# EAGLE design AR0130_DEV_BOARD_BREAKOUT (EAGLE 8.7.1)
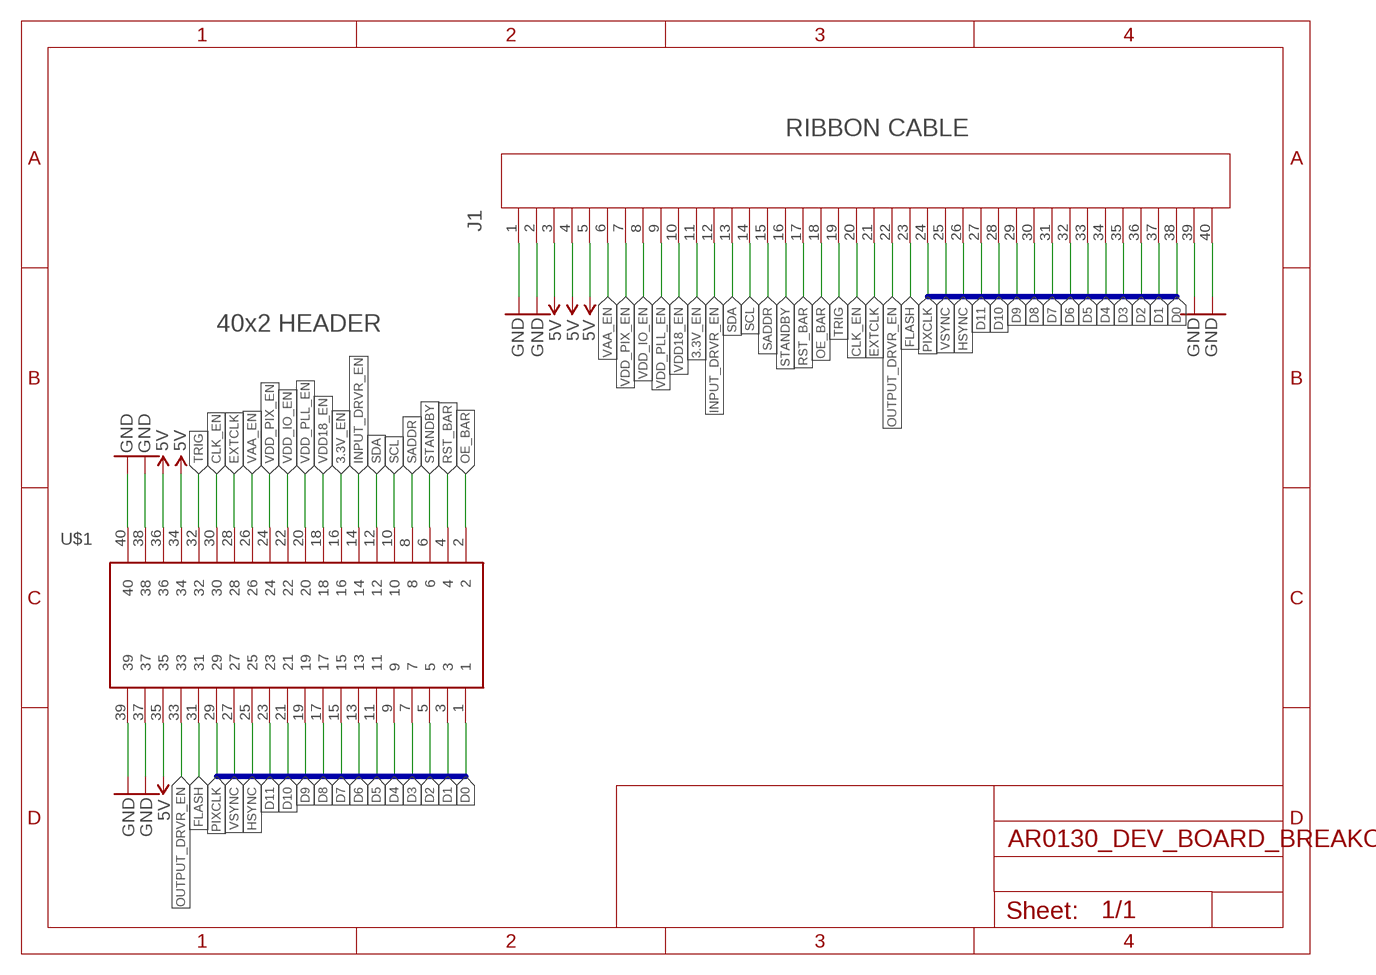
[diagram p0: schematic, sheet 1]

## Parts
J1  4-1734592-0  [CONN_4-1734592-0_TYCO]
U$1  HTSW-120-XX-XXX-D  [CON40_2X20_TU_TSW]

## Nets
3.3V_EN: J1.11 U$1.16
5V: J1.3 J1.4 J1.5 U$1.34 U$1.35 U$1.36
CLK_EN: J1.20 U$1.30
D0: J1.38 U$1.1
D1: J1.37 U$1.3
D2: J1.36 U$1.5
D3: J1.35 U$1.7
D4: J1.34 U$1.9
D5: J1.33 U$1.11
D6: J1.32 U$1.13
D7: J1.31 U$1.15
D8: J1.30 U$1.17
D9: J1.29 U$1.19
D10: J1.28 U$1.21
D11: J1.27 U$1.23
EXTCLK: J1.21 U$1.28
FLASH: J1.23 U$1.31
GND: J1.1 J1.2 J1.39 J1.40 U$1.37 U$1.38 U$1.39 U$1.40
HSYNC: J1.26 U$1.25
INPUT_DRVR_EN: J1.12 U$1.14
OE_BAR: J1.18 U$1.2
OUTPUT_DRVR_EN: J1.22 U$1.33
PIXCLK: J1.24 U$1.29
RST_BAR: J1.17 U$1.4
SADDR: J1.15 U$1.8
SCL: J1.14 U$1.10
SDA: J1.13 U$1.12
STANDBY: J1.16 U$1.6
TRIG: J1.19 U$1.32
VAA_EN: J1.6 U$1.26
VDD18_EN: J1.10 U$1.18
VDD_IO_EN: J1.8 U$1.22
VDD_PIX_EN: J1.7 U$1.24
VDD_PLL_EN: J1.9 U$1.20
VSYNC: J1.25 U$1.27

## Buses
D[0..11],HSYNC,VSYNC,PIXCLK

## Notes on the sheet
- RIBBON CABLE
- 40x2 HEADER

## Library data of the parts
J1 = Oliver_Custom:4-1734592-0; MANUFACTURER_PART_NUMBER: 417345920; VENDOR: TE Connectivity
U$1 = Oliver_Custom:HTSW-120-XX-XXX-D

## Board
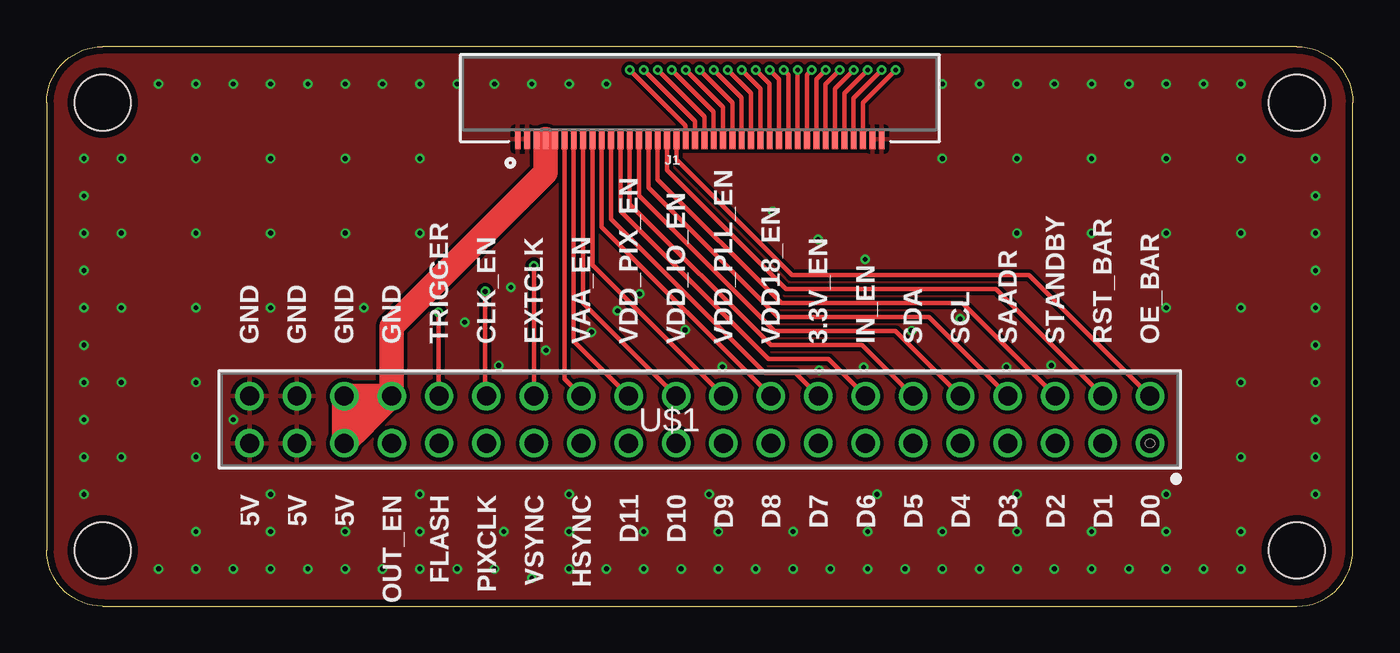
[diagram p1: board, top side]
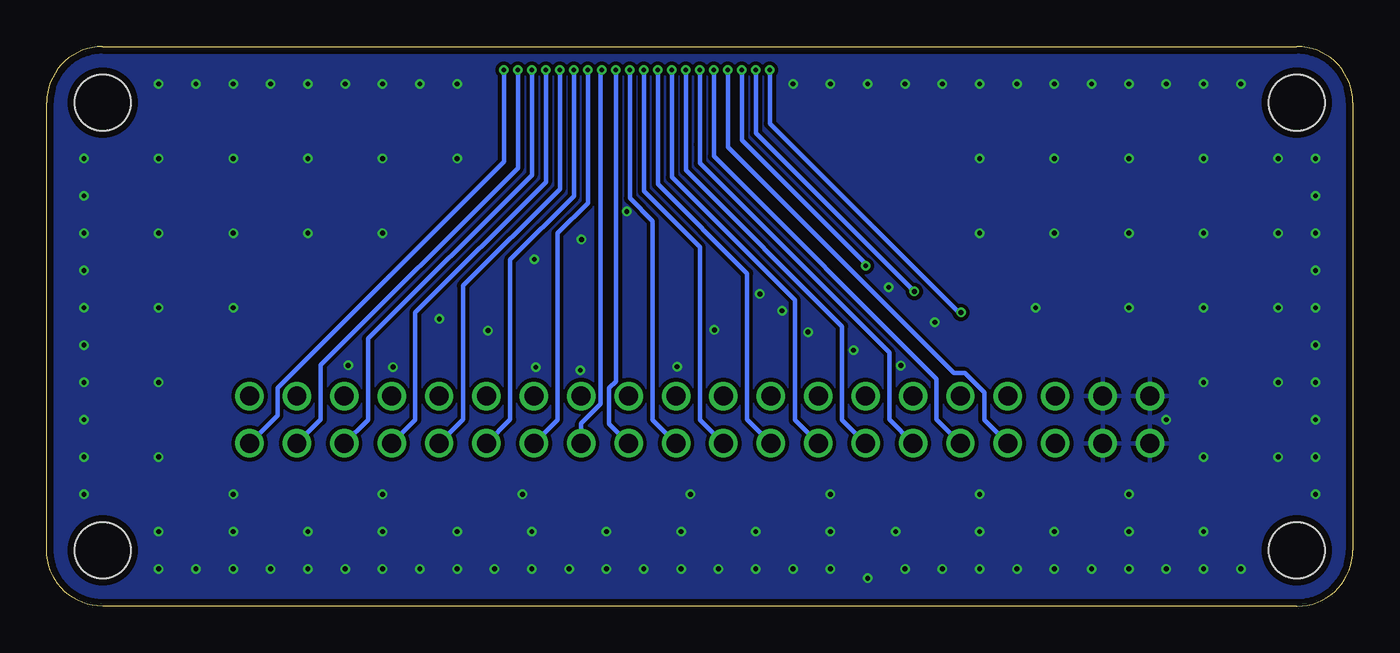
[diagram p2: board, bottom side, seen from below]

Size 70 x 30 mm. Coordinates in mm from the lower left corner, seen from the top.
Outline: 3,0 67,0 arc90 70,3 70,27 arc90 67,30 3,30 arc90 0,27 0,3 arc90 3,0
Copper layers (1*16): Top 0.035559375mm / dielectric 1.6mm / Bottom 0.035559375mm
Design rules "oshpark-2layer-tented": minimum track width 6mil, minimum drill 10mil, track to track 6mil, track to pad 6mil, pad to pad 6mil, via to via 6mil, smd to smd 6mil, copper to edge 15mil, drill to drill 6mil, minimum pad ring 5mil, minimum via ring 5mil, stop-mask expansion 2.5mil, vias tented up to drill 20mil, thermal gap 10mil
Holes 3 mm at 3,3 67,3 3,27 67,27

### Footprints (pad centres in the part's own frame; a part is rotated, then mirrored left to right if it is on the bottom)
CONN_4-1734592-0_TYCO = smd 0.305 x 1.092: 1 -9.751,0; 2 -9.251,0; 3 -8.751,0; 4 -8.251,0; 5 -7.75,0; 6 -7.25,0; 7 -6.75,0; 8 -6.25,0; 9 -5.751,0; 10 -5.25,0; 11 -4.75,0; 12 -4.25,0; 13 -3.751,0; 14 -3.251,0; 15 -2.751,0; 16 -2.251,0; 17 -1.75,0; 18 -1.25,0; 19 -0.751,0; 20 -0.251,0; 21 0.249,0; 22 0.75,0; 23 1.25,0; 24 1.749,0; 25 2.249,0; 26 2.749,0; 27 3.249,0; 28 3.749,0; 29 4.249,0; 30 4.75,0; 31 5.25,0; 32 5.749,0; 33 6.25,0; 34 6.749,0; 35 7.25,0; 36 7.75,0; 37 8.249,0; 38 8.749,0; 39 9.249,0; 40 9.749,0
CON40_2X20_TU_TSW = drill 1.016 pad 1.524: 1 24.13,-1.27; 2 24.13,1.27; 3 21.59,-1.27; 4 21.59,1.27; 5 19.05,-1.27; 6 19.05,1.27; 7 16.51,-1.27; 8 16.51,1.27; 9 13.97,-1.27; 10 13.97,1.27; 11 11.43,-1.27; 12 11.43,1.27; 13 8.89,-1.27; 14 8.89,1.27; 15 6.35,-1.27; 16 6.35,1.27; 17 3.81,-1.27; 18 3.81,1.27; 19 1.27,-1.27; 20 1.27,1.27; 21 -1.27,-1.27; 22 -1.27,1.27; 23 -3.81,-1.27; 24 -3.81,1.27; 25 -6.35,-1.27; 26 -6.35,1.27; 27 -8.89,-1.27; 28 -8.89,1.27; 29 -11.43,-1.27; 30 -11.43,1.27; 31 -13.97,-1.27; 32 -13.97,1.27; 33 -16.51,-1.27; 34 -16.51,1.27; 35 -19.05,-1.27; 36 -19.05,1.27; 37 -21.59,-1.27; 38 -21.59,1.27; 39 -24.13,-1.27; 40 -24.13,1.27

### Placement (x,y rotation side)
J1  35,25.04 0 top
U$1  35,10 0 top

### Tracks (layer width: path | path; a pad name or v marks a point on that pad's centre or on a via)
3.3V_EN
  Top 0.254: J1.11 30.25,20.75 38.5,12.5 40.12,12.5 U$1.16
5V
  Top 0.254: J1.3 J1.4 J1.5
  Top 1.3: U$1.35 U$1.36 17,11.27 | 17,11.27 U$1.34 | U$1.34 18.49,14.99 26.75,23.25 J1.4 | U$1.35 U$1.34 | U$1.35 17,9.78 17,11.27
CLK_EN  (via drill 0.25)
  Top 0.254: J1.20 34.75,26 32.53,28.22 32.22,28.53 v32,28.75 | v23.5,16.88 23.5,11.34 U$1.30
  Bottom 0.254: v32,28.75 32,25.38 v23.5,16.88
D0  (via drill 0.25 pad 0.46)
  Top 0.254: J1.38 43.75,27 44.97,28.22 45.28,28.53 v45.5,28.75
  Bottom 0.254: U$1.1 57.63,10.23 57.63,11.7 45.5,23.83 v45.5,28.75
D1  (via drill 0.25 pad 0.46)
  Top 0.254: J1.37 43.25,27.25 44.22,28.22 44.53,28.53 v44.75,28.75
  Bottom 0.254: U$1.3 55.31,10.01 55.31,12.94 44.75,23.5 v44.75,28.75
D2  (via drill 0.25 pad 0.46)
  Top 0.254: J1.36 42.75,27.5 43.47,28.22 43.78,28.53 v44,28.75
  Bottom 0.254: U$1.5 52.78,10 52.78,14.34 44,23.12 v44,28.75
D3  (via drill 0.25 pad 0.46)
  Top 0.254: J1.35 42.25,27.75 42.72,28.22 43.03,28.53 v43.25,28.75
  Bottom 0.254: v43.25,28.75 43.25,22.75 50.25,15.75 50.25,9.99 U$1.7
D4  (via drill 0.25 pad 0.46)
  Top 0.254: J1.34 41.75,28 41.97,28.22 42.28,28.53 v42.5,28.75
  Bottom 0.254: v42.5,28.75 42.5,22.38 47.69,17.19 47.69,10.01 U$1.9
D5  (via drill 0.25 pad 0.46)
  Top 0.254: J1.33 41.25,28.25 41.53,28.53 v41.75,28.75
  Bottom 0.254: U$1.11 45.16,10 45.16,18.59 41.75,22 v41.75,28.75
D6  (via drill 0.25 pad 0.46)
  Top 0.254: J1.32 40.75,28.5 40.78,28.53 v41,28.75
  Bottom 0.254: U$1.13 42.62,9.99 42.62,20 41,21.62 v41,28.75
D7  (via drill 0.25 pad 0.46)
  Top 0.254: J1.31 v40.25,28.75
  Bottom 0.254: U$1.15 41.35,9.8 40.31,10.84 40.31,28.69 v40.25,28.75
D8  (via drill 0.25 pad 0.46)
  Top 0.254: J1.30 39.75,28.5 39.72,28.53 v39.5,28.75
  Bottom 0.254: v39.5,28.75 39.5,12.05 39.85,11.7 39.85,9.77 U$1.17
D9  (via drill 0.25 pad 0.46)
  Top 0.254: J1.29 39.25,28.25 38.97,28.53 v38.75,28.75
  Bottom 0.254: U$1.19 37.53,9.99 37.53,20.66 38.75,21.88 v38.75,28.75
D10  (via drill 0.25 pad 0.46)
  Top 0.254: J1.28 38.75,28 38.53,28.22 38.22,28.53 v38,28.75
  Bottom 0.254: U$1.21 35,10 35,19.25 38,22.25 v38,28.75
D11  (via drill 0.25 pad 0.46)
  Top 0.254: J1.27 38.25,27.75 37.78,28.22 37.47,28.53 v37.25,28.75
  Bottom 0.254: U$1.23 32.47,10.01 32.47,17.84 37.25,22.62 v37.25,28.75
EXTCLK  (via drill 0.25)
  Top 0.254: J1.21 35.25,26.25 33.28,28.22 32.97,28.53 v32.75,28.75 | 26.11,18.36 v26.11,18.25 U$1.28
  Bottom 0.254: v32.75,28.75 32.75,25 26.11,18.36 v26.11,18.25
FLASH  (via drill 0.25)
  Top 0.254: J1.23 36.25,26.75 34.78,28.22 34.47,28.53 v34.25,28.75
  Bottom 0.254: v34.25,28.75 34.25,24.12 22.31,12.19 22.31,10.01 U$1.31
GND  (via drill 0.25)
  other vias: 10,10 6,2 8,2 10,2 12,2 14,2 16,2 18,2 20,2 22,2 24,2 26,1.5 28,2 30,2 32,2 34,2 36,2 38,2 40,2 42,2 44,2 46,2 48,2 50,2 52,2 54,2 56,2 58,2 60,2 62,2 64,2 68,6 68,8 68,10 68,12 68,14 68,16 68,18 68,20 68,22 2,6 2,8 2,10 2,12 2,14 2,16 2,18 2,20 2,22 2,24 6,28 8,28 10,28 12,28 14,28 16,28 18,28 20,28 22,28 24,28 26,28 28,28 30,28 48,28 50,28 52,28 54,28 56,28 58,28 60,28 62,28 64,28 8,24 12,24 16,24 20,24 20,20 16,20 12,20 8,20 8,16 12,16 17,16 4,16 4,20 4,24 4,12 8,12 8,8 4,8 8,4 12,4 16,4 20,4 24.5,4 28,4 32,4 36,4 40,4 44,4 48,4 52,4 56,4 60,4 64,4 64,8 64,12 64,16 60,16 60,20 64,20 64,24 60,24 68,24 56,24 56,20 52,20 52,24 48,24 22.4,15.22 24.88,17.1 31.77,16.74 34.21,14.81 36.21,12.84 30.59,15.84 41.34,19.66 43.86,18.6 46.35,14.78 48.95,15.4 53.84,12.91 51.44,12.82 43.79,12.81 41.4,12.65 38.91,21.16 29.2,14.7 26.76,13.72 24.23,12.9 12,6 20,6 28,6 35.5,6 44.5,6 52,6 60,6
  pour Top (isolate 0.2): 0,0 70,0 70,25.75 70,30 44.5,30 0,30
  pour Bottom (isolate 0.2): 0,0 70,0 70,25.75 70,30 44.5,30 0,30
HSYNC  (via drill 0.25 pad 0.46)
  Top 0.254: J1.26 37.75,27.5 37.03,28.22 36.72,28.53 v36.5,28.75
  Bottom 0.254: U$1.25 29.91,9.99 29.91,16.41 36.5,23 v36.5,28.75
INPUT_DRVR_EN
  Top 0.254: J1.12 30.75,21.19 38.69,13.25 41.91,13.25 U$1.14
OE_BAR
  Top 0.254: J1.18 33.75,23.94 39.94,17.75 52.65,17.75 U$1.2
OUTPUT_DRVR_EN  (via drill 0.25)
  Top 0.254: J1.22 35.75,26.5 34.03,28.22 33.72,28.53 v33.5,28.75
  Bottom 0.254: U$1.33 19.75,9.99 19.75,11.46 20.79,12.5 21.38,12.5 33.5,24.62 v33.5,28.75
PIXCLK  (via drill 0.25 pad 0.46)
  Top 0.254: J1.24 36.75,27 35.53,28.22 35.22,28.53 v35,28.75
  Bottom 0.254: U$1.29 24.84,10 24.84,13.59 35,23.75 35,24.75 v35,28.75
RST_BAR
  Top 0.254: J1.17 33.25,23.38 39.62,17 50.86,17 U$1.4
SADDR
  Top 0.254: J1.15 32.25,22.44 39.19,15.5 47.28,15.5 U$1.8
SCL
  Top 0.254: J1.14 31.75,22 39,14.75 45.49,14.75 U$1.10
SDA
  Top 0.254: J1.13 31.25,21.56 38.81,14 43.7,14 U$1.12
STANDBY
  Top 0.254: J1.16 32.75,22.88 39.38,16.25 49.07,16.25 U$1.6
TRIG  (via drill 0.25)
  Top 0.254: J1.19 34.25,25.75 31.78,28.22 31.47,28.53 v31.25,28.75 | v21,15.75 21,11.3 U$1.32
  Bottom 0.254: v31.25,28.75 31.25,25.88 21.12,15.75 v21,15.75
VAA_EN
  Top 0.254: J1.6 27.75,12.17 U$1.26
VDD18_EN
  Top 0.254: J1.10 29.75,20.33 U$1.18
VDD_IO_EN
  Top 0.254: J1.8 28.75,16.25 U$1.22
VDD_PIX_EN
  Top 0.254: J1.7 28.25,14.21 U$1.24
VDD_PLL_EN
  Top 0.254: J1.9 29.25,18.29 U$1.20
VSYNC  (via drill 0.25 pad 0.46)
  Top 0.254: J1.25 37.25,27.25 36.28,28.22 35.97,28.53 v35.75,28.75
  Bottom 0.254: U$1.27 27.38,9.99 27.38,15 35.75,23.38 v35.75,28.75

### Text on the board
tPlace: GND | GND | GND | GND | TRIGGER | CLK_EN | EXTCLK | VAA_EN | VDD_PIX_EN | VDD_IO_EN | VDD_PLL_EN | VDD18_EN | 3.3V_EN | IN_EN | SDA | SCL | SAADR | STANDBY | RST_BAR | OE_BAR | 5V | 5V | 5V | OUT_EN | FLASH | PIXCLK | VSYNC | HSYNC | D11 | D10 | D9 | D8 | D7 | D6 | D5 | D4 | D3 | D2 | D1 | D0